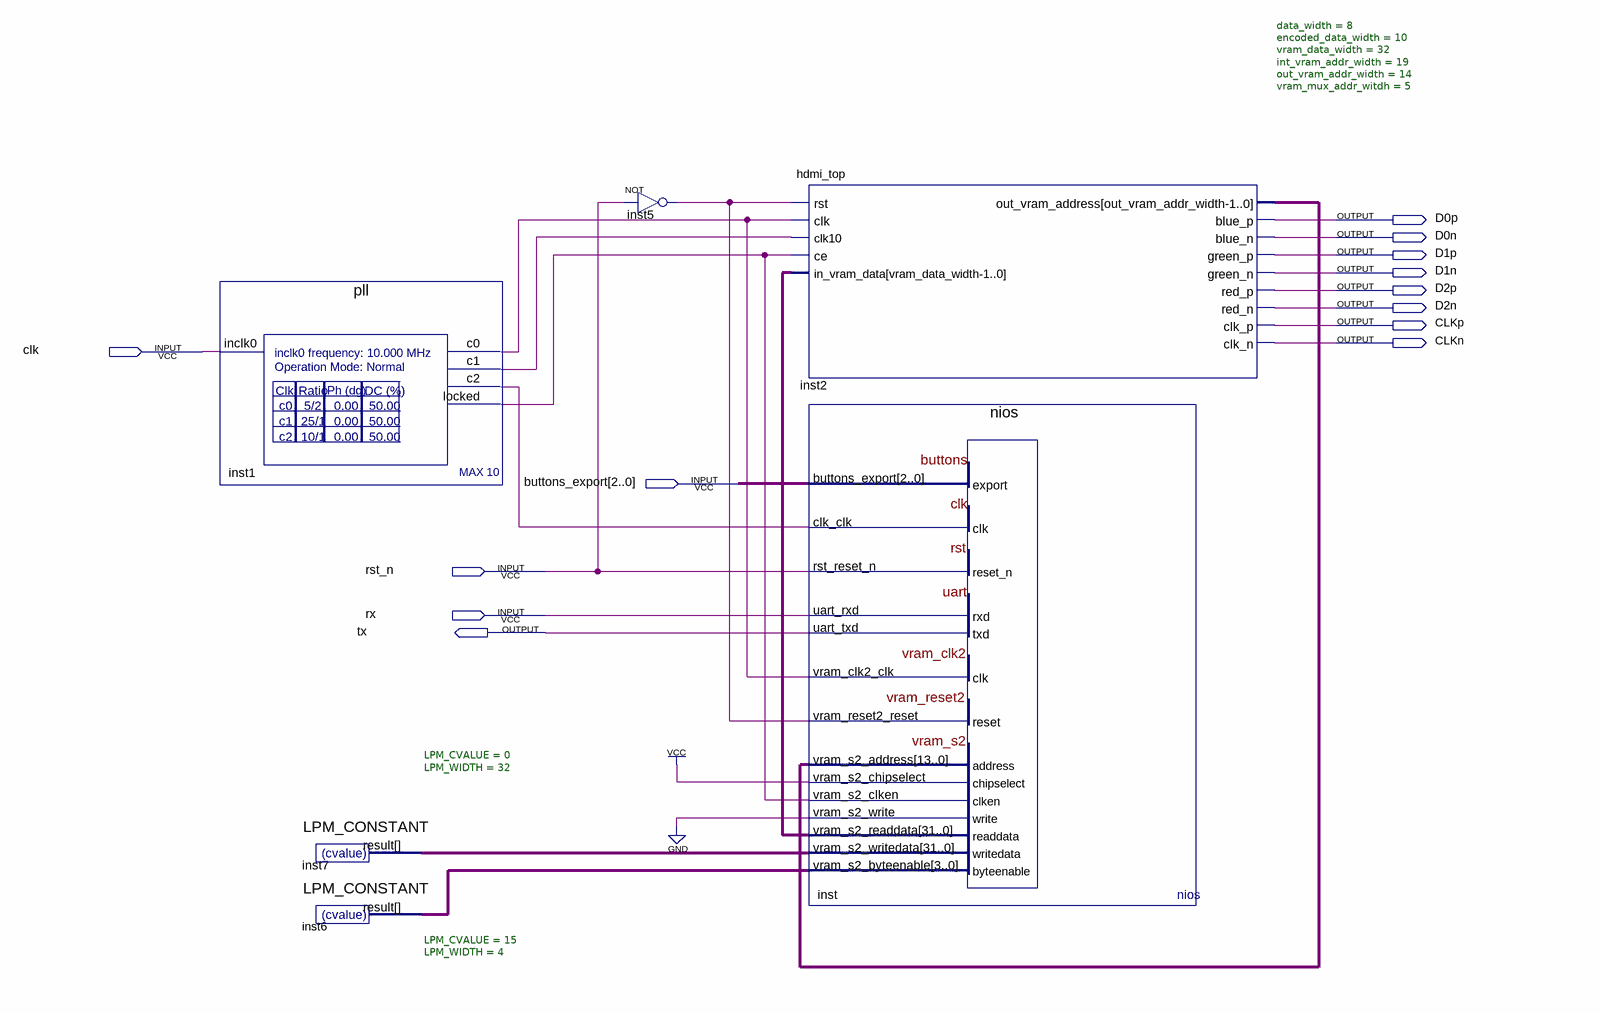
[diagram p0: schematic sheet]
// Quartus schematic top_level.bdf as structural Verilog: 6 symbols, 13 pins
module top_level (
  input  clk,
  input  [2:0] buttons_export,
  input  rst_n,
  input  rx,
  output D0p,
  output D0n,
  output D1p,
  output D1n,
  output D2p,
  output D2n,
  output CLKp,
  output CLKn,
  output tx
);

  wire inst1_c0, inst1_c1, inst1_c2, inst1_locked, inst5_out;
  wire [3:0] inst6_result;
  wire [13:0] inst2_out_vram_address;
  wire [31:0] inst7_result, inst_vram_s2_readdata;

  pll inst1 (.inclk0(clk), .c0(inst1_c0), .c1(inst1_c1), .c2(inst1_c2), .locked(inst1_locked));
  LPM_CONSTANT #(.LPM_CVALUE(0), .LPM_WIDTH(32)) inst7 (.result(inst7_result));
  LPM_CONSTANT #(.LPM_CVALUE(15), .LPM_WIDTH(4)) inst6 (.result(inst6_result));
  not inst5 (inst5_out, rst_n);
  hdmi_top #(.data_width(8), .encoded_data_width(10), .vram_data_width(32), .int_vram_addr_width(19), .out_vram_addr_width(14), .vram_mux_addr_witdh(5)) inst2 (
    .rst(inst5_out), .clk(inst1_c0), .clk10(inst1_c1), .ce(inst1_locked),
    .in_vram_data(inst_vram_s2_readdata), .out_vram_address(inst2_out_vram_address), .blue_p(D0p),
    .blue_n(D0n), .green_p(D1p), .green_n(D1n), .red_p(D2p), .red_n(D2n), .clk_p(CLKp), .clk_n(CLKn));
  nios inst (
    .buttons_export(buttons_export), .clk_clk(inst1_c2), .rst_reset_n(rst_n), .uart_rxd(rx),
    .vram_clk2_clk(inst1_c0), .vram_reset2_reset(inst5_out), .vram_s2_address(inst2_out_vram_address),
    .vram_s2_chipselect(1'b1), .vram_s2_clken(inst1_locked), .vram_s2_write(1'b0),
    .vram_s2_writedata(inst7_result), .vram_s2_byteenable(inst6_result), .uart_txd(tx),
    .vram_s2_readdata(inst_vram_s2_readdata));
endmodule
